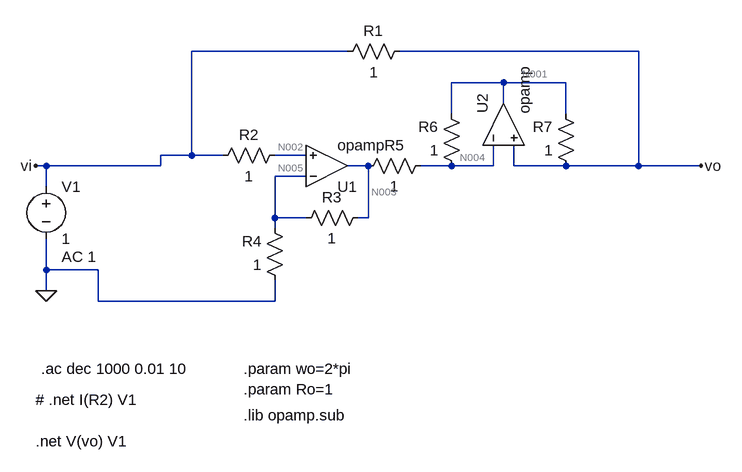
[diagram p0: schematic 4.asc]
4.asc, the LTspice schematic file:
Version 4.1
SHEET 1 880 680
WIRE 192 -96 -48 -96
WIRE 640 -96 272 -96
WIRE 432 -48 352 -48
WIRE 528 -48 432 -48
WIRE 432 -16 432 -48
WIRE 352 0 352 -48
WIRE 528 0 528 -48
WIRE -48 64 -48 -96
WIRE -48 64 -96 64
WIRE 0 64 -48 64
WIRE 128 64 80 64
WIRE -272 80 -288 80
WIRE -96 80 -96 64
WIRE -96 80 -272 80
WIRE 224 80 192 80
WIRE 352 80 304 80
WIRE 416 80 416 48
WIRE 416 80 352 80
WIRE 448 80 448 48
WIRE 528 80 448 80
WIRE 640 80 640 -96
WIRE 640 80 528 80
WIRE 736 80 640 80
WIRE 128 96 80 96
WIRE -272 112 -272 80
WIRE 80 160 80 96
WIRE 128 160 80 160
WIRE 224 160 224 80
WIRE 224 160 208 160
WIRE 80 176 80 160
WIRE -272 240 -272 192
WIRE -192 240 -272 240
WIRE -272 272 -272 240
WIRE -192 288 -192 240
WIRE 80 288 80 256
WIRE 80 288 -192 288
FLAG -288 80 vi
FLAG 736 80 vo
FLAG -272 272 0
SYMBOL voltage -272 96 R0
WINDOW 123 24 124 Left 2
WINDOW 39 0 0 Left 0
SYMATTR Value2 AC 1
SYMATTR InstName V1
SYMATTR Value 1
SYMBOL res 288 -112 R90
WINDOW 0 0 56 VBottom 2
WINDOW 3 32 56 VTop 2
SYMATTR InstName R1
SYMATTR Value 1
SYMBOL res 96 48 R90
WINDOW 0 0 56 VBottom 2
WINDOW 3 32 56 VTop 2
SYMATTR InstName R2
SYMATTR Value 1
SYMBOL res 224 144 R90
WINDOW 0 0 56 VBottom 2
WINDOW 3 32 56 VTop 2
SYMATTR InstName R3
SYMATTR Value 1
SYMBOL res 96 272 R180
WINDOW 0 36 76 Left 2
WINDOW 3 36 40 Left 2
SYMATTR InstName R4
SYMATTR Value 1
SYMBOL res 320 64 R90
WINDOW 0 0 56 VBottom 2
WINDOW 3 32 56 VTop 2
SYMATTR InstName R5
SYMATTR Value 1
SYMBOL res 368 96 R180
WINDOW 0 36 76 Left 2
WINDOW 3 36 40 Left 2
SYMATTR InstName R6
SYMATTR Value 1
SYMBOL res 544 96 R180
WINDOW 0 36 76 Left 2
WINDOW 3 36 40 Left 2
SYMATTR InstName R7
SYMATTR Value 1
SYMBOL OpAmps\\opamp 160 144 M180
SYMATTR InstName U1
SYMBOL OpAmps\\opamp 368 16 R270
SYMATTR InstName U2
TEXT -280 392 Left 2 !.ac dec 1000 0.01 10
TEXT -288 440 Left 2 !# .net I(R2) V1
TEXT -288 504 Left 2 !.net V(vo) V1
TEXT 32 392 Left 2 !.param wo=2*pi
TEXT 32 424 Left 2 !.param Ro=1
TEXT 32 464 Left 2 !.lib opamp.sub

The netlist it stands for:
* 4.asc
V1 vi 0 1 AC 1
R1 vo vi 1
R2 N002 vi 1
R3 N003 N005 1
R4 0 N005 1
R5 N004 N003 1
R6 N004 N001 1
R7 vo N001 1
X§U1 N005 N002 N003 opamp Aol=100K GBW=10Meg  ; pins invin noninvin out
X§U2 N004 vo N001 opamp Aol=100K GBW=10Meg  ; pins invin noninvin out
.ac dec 1000 0.01 10
# .net I(R2) V1
.net V(vo) V1
.param wo=2*pi
.param Ro=1
.lib opamp.sub
.backanno
.end

* Results of the author's LTspice run, read from the files saved beside the schematic
* Operating Point, zero values left out:
*   V(n001) = -20 kV
*   V(n002) = 1 V
*   V(n003) = 1.8 V
*   V(n004) = -9.998 kV
*   V(n005) = 900 mV
*   V(vi) = 1 V
*   V(vo) = -9.998 kV
*   I(R1) = -9.999 kA
*   I(R3) = 900 mA
*   I(R4) = -900 mA
*   I(R5) = -10 kA
*   I(R6) = 10 kA
*   I(R7) = 9.999 kA
*   I(V1) = -9.999 kA
*   Ix(u1:3) = -10 kA
*   Ix(u2:3) = 20 kA